# Altium schematic sheet USB-to-UART.SchDoc
size A4; SheetNumber: 1; SheetTotal: 1
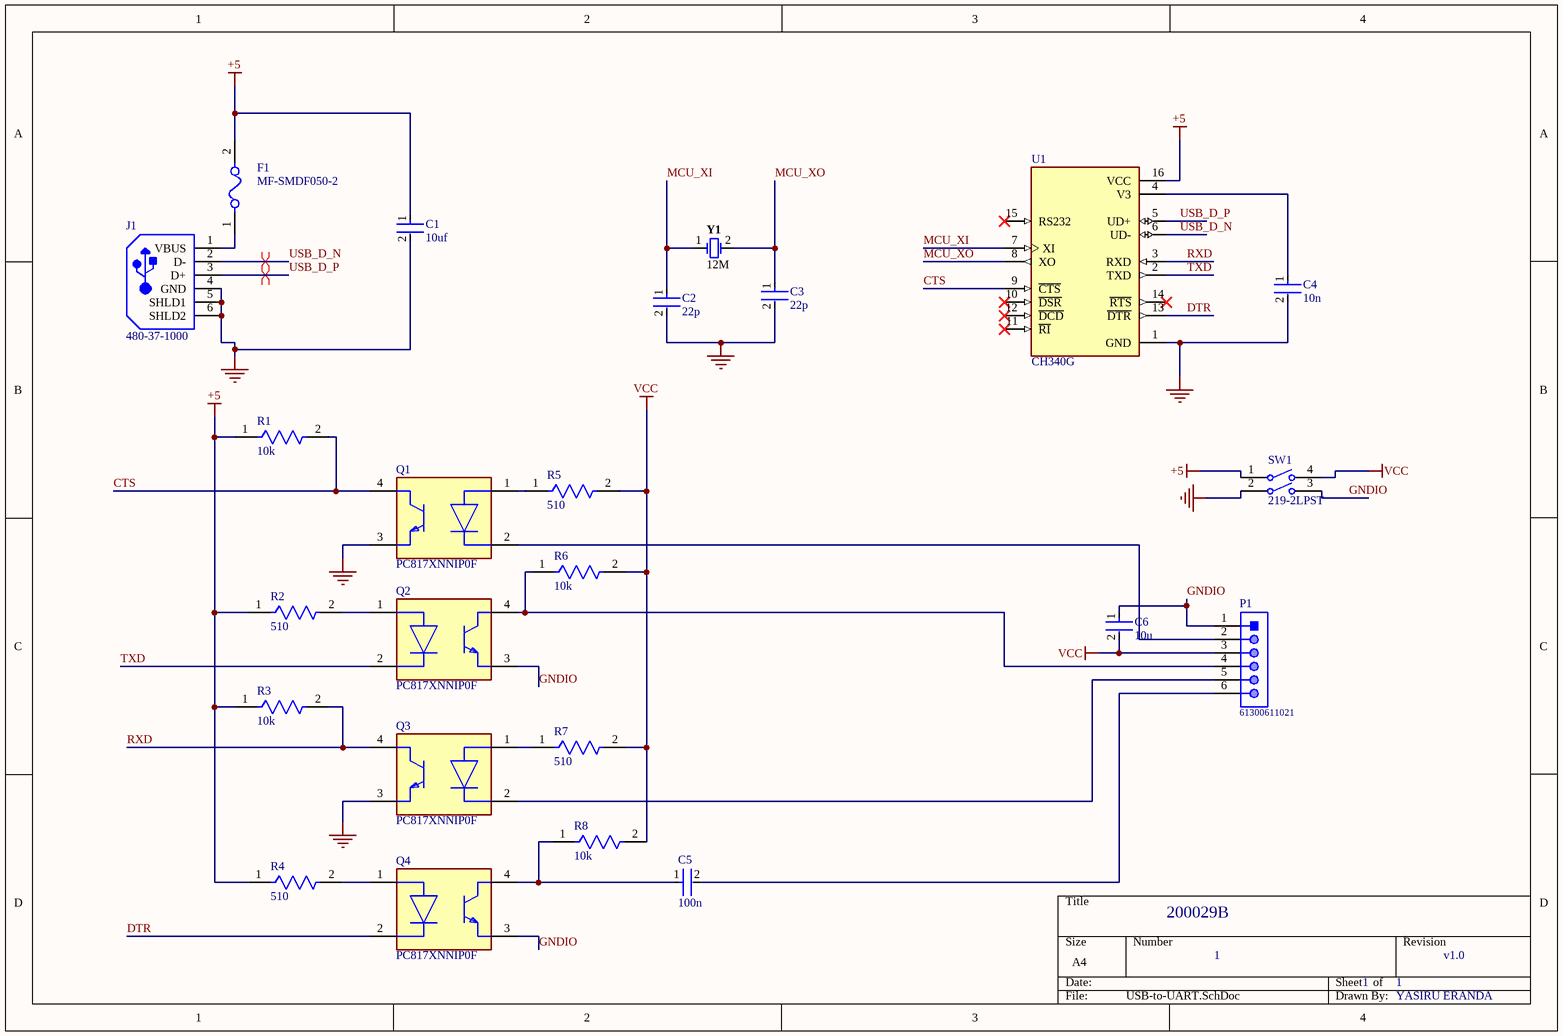
[diagram p0: USB-to-UART.SchDoc]

## Parts
C1  10uf  [FP-0805P-MFG]
C2  22p  [FP-0603-L_1_6_0_15-W_0_81-IPC_C]
C3  22p  [FP-0603-L_1_6_0_15-W_0_81-IPC_C]
C4  10n  [FP-0603-L_1_6_0_15-W_0_81-IPC_C]
C5  100n  [FP-0603-L_1_6_0_15-W_0_81-IPC_C]
C6  10u  [FP-0805P-MFG]
F1  MF-SMDF050-2  [FP-MF-SMDF-MFG]
J1  480-37-1000  [MOLX-480-37-1000_V]
P1  61300611021  [61300611021]
Q1  PC817XNNIP0F  [FP-PC817XNNIP0F-MFG]
Q2  PC817XNNIP0F  [FP-PC817XNNIP0F-MFG]
Q3  PC817XNNIP0F  [FP-PC817XNNIP0F-MFG]
Q4  PC817XNNIP0F  [FP-PC817XNNIP0F-MFG]
R1  10k  [FP-CRGP0603-IPC_C]
R2  510  [FP-CR0603-IPC_A]
R3  10k  [FP-CRGP0603-IPC_C]
R4  510  [FP-CR0603-IPC_A]
R5  510  [FP-CR0603-IPC_A]
R6  10k  [FP-CRGP0603-IPC_C]
R7  510  [FP-CR0603-IPC_A]
R8  10k  [FP-CRGP0603-IPC_C]
SW1  219-2LPST  [CTS-219-2LPST_V]
U1  CH340G  [SOIC127P600X180-16N]
Y1  12M  [FOX-FOXSLF-2_V]

## Nets
+5: C1.1 F1.2 R1.1 R2.1 R3.1 R4.1 SW1.1 U1.16(VCC)
GND: C1.2 C2.2 C3.2 C4.2 J1.4(GND) J1.5(SHLD1) J1.6(SHLD2) Q1.3(E) Q3.3(E) SW1.2 U1.1(GND)
VCC: C6.2 P1.3 R5.2 R6.2 R7.2 R8.2 SW1.4
CTS: Q1.4(C) R1.2 U1.9(~{CTS})
DTR: Q4.2(C) U1.13(~{DTR})
GNDIO: C6.1 P1.1 Q2.3(E) Q4.3(E) SW1.3
MCU_XI: C2.1 U1.7(XI) Y1.1
MCU_XO: C3.1 U1.8(XO) Y1.2
RXD: Q3.4(C) R3.2 U1.3(RXD)
TXD: Q2.2(C) U1.2(TXD)
USB_D_N: J1.2(D-) U1.6(UD-)
USB_D_P: J1.3(D+) U1.5(UD+)
NetC4_1: C4.1 U1.4(V3)
NetC5_1: C5.1 Q4.4(C) R8.1
NetC5_2: C5.2 P1.6
NetF1_1: F1.1 J1.1(VBUS)
NetP1_2: P1.2 Q1.2(C)
NetP1_4: P1.4 Q2.4(C) R6.1
NetP1_5: P1.5 Q3.2(C)
NetQ1_1: Q1.1(A) R5.1
NetQ2_1: Q2.1(A) R2.2
NetQ3_1: Q3.1(A) R7.1
NetQ4_1: Q4.1(A) R4.2

Not connected (* = marked no-connect by the designer): U1 10(~{DSR})* 11(~{RI})* 12(~{DCD})* 14(~{RTS})* 15(RS232)*

## Layout directives
differential pair; differential pair class DIFF_USB: USB_D_N, USB_D_P

## Notes on the sheet
- 200029B
- 1
- v1.0
- YASIRU ERANDA

## Library data of the parts
C1 C6 = CMP-2007-04802-2: CAP CER 10UF 25V X5R 0805; Tolerance: 10%; Width: 0.049inch; Voltage Rating (DC): 25V; Mount: Surface Mount; Length: 2.01mm; Series: -; REACH SVHC: No SVHC; Min Operating Temperature: -55°C; Case Code (Metric): 2012; Contact Plating: Tin; Thickness: 0.051inch; Depth: 1.25mm; Case Code (Imperial): 0805; Dielectric: X5R; Voltage Rating: 25V; Height: 1.4mm; Termination: SMD/SMT; Lead Free: Lead Free; RoHS Compliant: Yes; Max Operating Temperature: 85°C; Case/Package: 0805; Number of Pins: 2; Package Quantity: 1; Capacitance: 10uF; Construction: Flat; Packaging: Tape and Reel; Radiation Hardening: No
C2-C5 = CMP-2006-04207-3: General Purpose Ceramic Capacitor, 0603, 22pF, 5%, NP0, 30ppm/°C, 50V; Dielectric: C0G; Insulation Resistance: 100GR; Termination: SMD/SMT; Lead Free: Lead Free; Package Quantity: 1; Thickness: 0.035inch; Packaging: Tape and Reel; Radiation Hardening: No; Voltage Rating: 50V; Depth: 0.81mm; Case Code (Metric): 1608; Min Operating Temperature: -55°C; Number of Pins: 2; REACH SVHC: No SVHC; RoHS Compliant: Yes; Mount: Surface Mount; Case/Package: 0603; Width: 0.81mm; Case Code (Imperial): 0603; Max Operating Temperature: 125°C; Contact Plating: Tin; Temperature Coefficient: 30ppm/°C; Voltage Rating (DC): 50V; Height: 0.63mm; Dielectric Material: Ceramic; Capacitance: 22pF; Voltage: 50V; Length: 1.6mm; Tolerance: 5%
F1 = CMP-07400-000008-1: PTC RESET FUSE 60V 550MA 2018; Manufacturer: Bourns Inc.; Trip Current: 1.2A; Resistance: 0.2-1Ω; Trip Time: 3s; Current Rating: 10A; Value: 0.2-1Ω; Hold Current: 0.55A; ComponentLink2Description: Datasheet; Device Class L2: PTC Resettable Fuses; Temperature Range Low: -40°C; Temperature: -40°C to +85°C; RoHS: TRUE; Package: MF-SMDF; Digikey Description: PTC RESET FUSE 60V 550MA 2018; Device Class L3: unset; Octopart: https://octopart.com/mf-smdf050-2-bourns-94955; Mouser Description: Resettable Fuses - PPTC 0.55A 60V 0.2ohm Hold 0.55A Trip1.2a; Category: Fuse; Height: 1.09mm; Manufacturer Part Number: MF-SMDF050-2; Temperature Range High: +85°C; Voltage Rating: 60V; Device Class L1: Circuit Protection; Ambient Temperature Range Low: -40°C; Automotive: No; Lead Free: Yes; ComponentLink2URL: https://bourns.com/data/global/pdfs/MFSMDF.pdf; Ambient Temperature Range High: +85°C
J1 = CMP-1676-00005-1: Universal Serial Bus (USB) Shielded I/O Plug, Type A, Right Angle Connector, 1.5 A, -20 to 85 degC, 4-Pin SMD, RoHS, Tray; Tolerance: 1%; Power Rating: 100 mW; Voltage Rating: 50 V; Case\Package: 0603; Resistance: 1 mohm; Width: 0.8 mm; Mount: Surface Mount; ComponentLink1URL: http://www.molex.com/; ComponentLink1Description: Manufacturer URL; REACH SVHC: No SVHC; Case Code (Imperial): 0603; Height: 0.45 mm; Max Operating Temperature: 155 degC; ComponentLink2Description: Datasheet; Min Operating Temperature: -55 degC; Length: 1.6 mm; Pins: 2; RoHSCompliant: true; Package Quantity: 5000; DatasheetVersion: Rev. D, 06/2004; PackageDescription: 4-Pin Surface Mount Device, Body 12 x 18.8 mm; Voltage Rating (DC): 50 V; PackageReference: 480-37-1000; Case Code (Metric): 1608; ComponentLink2URL: http://www.molex.com/pdm_docs/sd/480371000_sd.pdf; Packaging: Tape and Reel
P1 = CMP-1502-01069-1: THT Angled Pin Header WR-PHD, Pitch 2.54 mm, Single Row, 6 pins; Manufacturer: Wurth Elektronik; Pin Number: 6; Gender: Male; Withstanding Voltage: 500VAC; Rated Current: 3A; Working Voltage: 250VAC; Contact Resistance: 20mOhm; Pitch: 2.54mm; Operating Temperature: -40to105degC; Package Reference: 61300611021; Packaging: Bag; Orientation: Angled; Manufacturer URL: http://www.we-online.de; Datasheet URL: https://katalog.we-online.de/em/datasheet/6130xx11021.pdf; Mounting Technology: THT; Publisher: WurthElektronik; Row Number: Single; Part Number: 61300611021
Q1-Q4 = CMP-65434-000005-1: OPTOISOLATOR 5KV TRANS 4SMD; Reverse Breakdown Voltage: 6V; Output Current per Channel: 30mA; Power Dissipation: 200mW; Collector-emitter Voltage-Max: 200mV; Max Output Voltage: 80V; Input Current: 50mA; Forward Voltage: 1.4V; Fall Time: 18000ns; Number of Elements: 1; Input Type: DC; Packaging: Tape and Reel; RoHS Compliant: Yes; Contact Plating: Copper; Min Operating Temperature: -30°C; Collector Emitter Saturation Voltage: 200mV; Max Input Current: 50mA; Radiation Hardening: No; Max Collector Current: 50mA; Case/Package: SMD/SMT; Mount: Surface Mount; Output Voltage: 80V; Forward Current: 50mA; Max Power Dissipation: 200mW; Collector Emitter Voltage (VCEO): 80V; Number of Channels: 1; Rise Time: 18000ns; Isolation Voltage: 5kV; Number of Pins: 4; Lead Free: Lead Free; Package Quantity: 2000; Isolation Voltage-Max: 5kV; Max Operating Temperature: 100°C
R1 R3 R6 R8 = CMP-03211-004414-1: CRGP 0603 10K 1%; Manufacturer Part Number: CRGP0603F10K; Manufacturer: TE; Voltage Rating: 50V; Power Rating: 0.25W; Value: 10KΩ; Tolerance: 0.01; Temperature Coefficient: ±100ppm/°C; Octopart: https://octopart.com/crgp0603f10k-te+connectivity-91018721; Temperature Range Low: -55°C; Temperature Range High: +155°C; Device Class L3: Chip SMD Resistors; Package: CRGP0603; Height: 0.55mm; Series: CRGP; RoHS: TRUE; Composition: Thick Film; Digikey Description: CRGP 0603 10K 1%; Ipc Land Pattern Name: RESC16080X45; Mouser Description: Res, 10K, 1%, 0.25W, 0603, Thick Film; ComponentLink2Description: Datasheet; ComponentLink2URL: https://www.te.com/commerce/DocumentDelivery/DDEController?Action=srchrtrv&DocNm=9-1773463-9&DocType=DS&DocLang=English; Temperature: -55°C to +155°C; Device Class L1: Passive Components; Lead Free: Yes; Ambient Temperature Range High: +70°C; Device Class L2: Resistors; Automotive: No; Category: Res; Resistance: 10KΩ
R2 R4 R5 R7 = CMP-07231-001773-1: Thick Film Chip Resistors 0603 510Ω 0.1W 1% 100ppm/°C; Resistance: 510R; Power Rating: 100mW; Voltage Rating: 50V; Length: 1.6mm; Temperature Coefficient: 100ppm/°C; Width: 0.8mm; Case Code (Metric): 1608; Mount: Surface Mount; Case/Package: 0603; Radiation Hardening: No; Composition: Thick Film; Min Operating Temperature: -55°C; Termination: SMD/SMT; Packaging: Tape and Reel; Max Operating Temperature: 155°C; Contact Plating: Tin; Package Quantity: 5000; Thickness: 457um; Tolerance: 1%; Case Code (Imperial): 0603; Height: 0.45mm
SW1 = CMP-2000-05532-1: Surface Mount DIP Switch Auto Placeable, -55 to 85 degC, 4-Pin SMD, RoHS, Tube; Manufacturer: CTS Corporation; Sealed Option: Sealed; Circuitry: SPST; No of Positions: 2; Actuator Style: LowProfile; Type: Dip; Package Reference: 219-2LPST; Mounting Technology: SurfaceMount; Datasheet Version: 12/2008; Package Description: 4-Pin Surface Mount Device, Body 6.7 x 6.55 mm; Datasheet URL: http://www.ctscorp.com/wp-content/uploads/2016/01/219-Dec-30-2008.pdf; Termination Style: GullWing; Manufacturer URL: http://www.ctscorp.com/
U1 = CH340G: USB Interface Integrated Circuit; MF: WCH; Value: *; SnapEDA_Link: https://www.snapeda.com/parts/Ch340G/WCH/view-part/?ref=snap; MP: Ch340G; Check_prices: https://www.snapeda.com/parts/Ch340G/WCH/view-part/?ref=eda; Availability: Not in stock; Price: None; Package: None
Y1 = CMP-1749-00004-1: Resistance Weld Thru-Hole Crystal, 12 MHz, +/-30 ppm, -20 to 70 degC, 2-Pin THD, RoHS, Bulk; Elements: 1; Rds On Max: 115 mohm; Typical Rise Time: 90 ns; Max Power Dissipation: 2.5 W; Case\Package: TO-251-3; Input Capacitance: 350 pF; REACH SVHC: No SVHC; Length: 6.6 mm; ComponentLink1URL: http://www.foxonline.com/; PackageDescription: 2-Pin Through Hole Device, Body 11.35 x 4.65 mm, Pitch 4.88 mm; Radiation Hardening: No; Package Quantity: 70; Packaging: Rail/Tube; ComponentLink1Description: Manufacturer URL; Min Operating Temperature: -55 degC; Max Operating Temperature: 150 degC; RoHSCompliant: true; PackageReference: FOXSLF-2; DatasheetVersion: Mar-15; Pins: 3; Height: 6.1 mm; Mount: Through Hole; ComponentLink2URL: http://www.foxonline.com/pdfs/hc49slf.pdf; ComponentLink2Description: Datasheet; Width: 2.3 mm